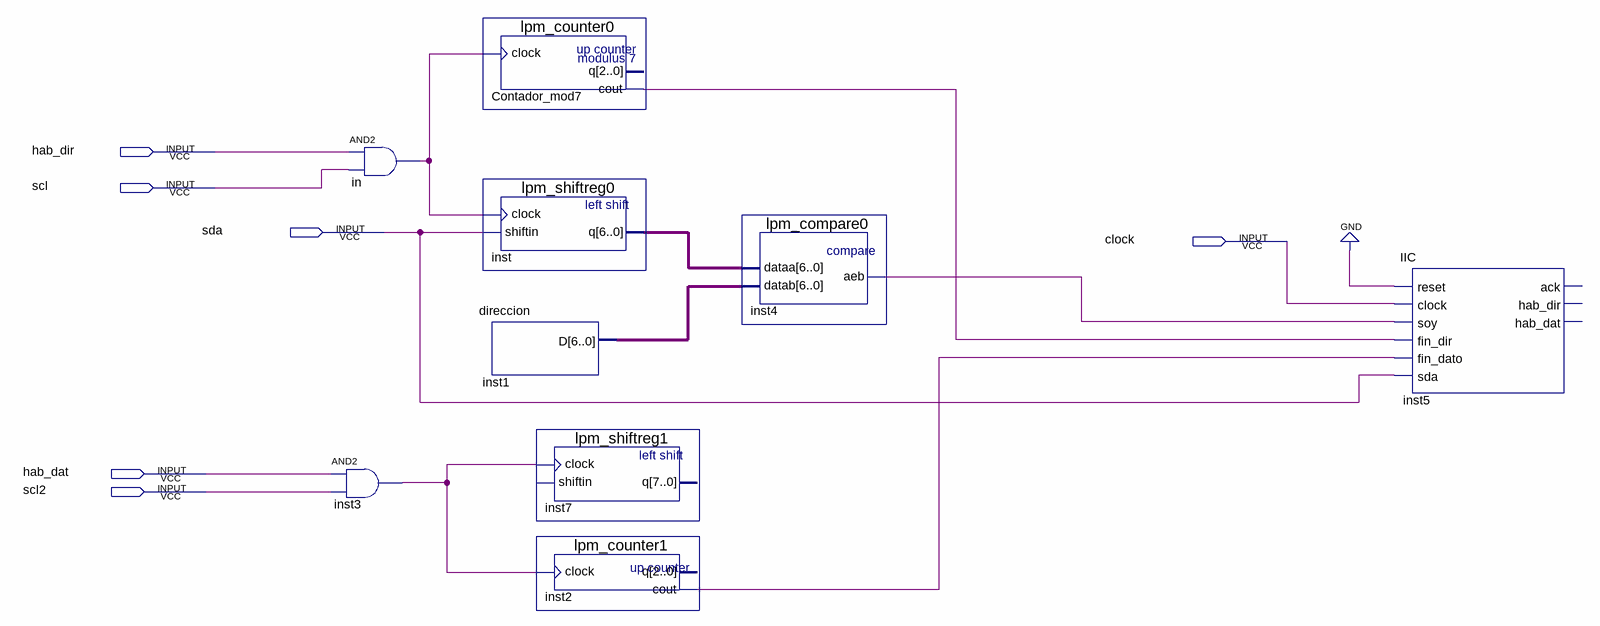
[diagram p0: schematic sheet]
// Quartus schematic Bloque_1.bdf as structural Verilog: 9 symbols, 6 pins
module Bloque_1 (
  input  hab_dir,
  input  scl,
  input  sda,
  input  clock,
  input  hab_dat,
  input  scl2
);

  wire Contador_mod7_cout, in_out, inst2_cout, inst3_out, inst4_aeb;
  wire [6:0] inst1_d, inst_q;

  and in (in_out, hab_dir, scl);
  and inst3 (inst3_out, hab_dat, scl2);
  lpm_counter0 Contador_mod7 (.clock(in_out), .cout(Contador_mod7_cout));  // open: q
  lpm_shiftreg0 inst (.clock(in_out), .shiftin(sda), .q(inst_q));
  direccion inst1 (.D(inst1_d));
  lpm_shiftreg1 inst7 (.clock(inst3_out));  // open: shiftin, q
  lpm_counter1 inst2 (.clock(inst3_out), .cout(inst2_cout));  // open: q
  lpm_compare0 inst4 (.dataa(inst_q), .datab(inst1_d), .aeb(inst4_aeb));
  IIC inst5 (
    .reset(1'b0), .clock(clock), .soy(inst4_aeb), .fin_dir(Contador_mod7_cout), .fin_dato(inst2_cout),
    .sda(sda));  // open: ack, hab_dir, hab_dat
endmodule
